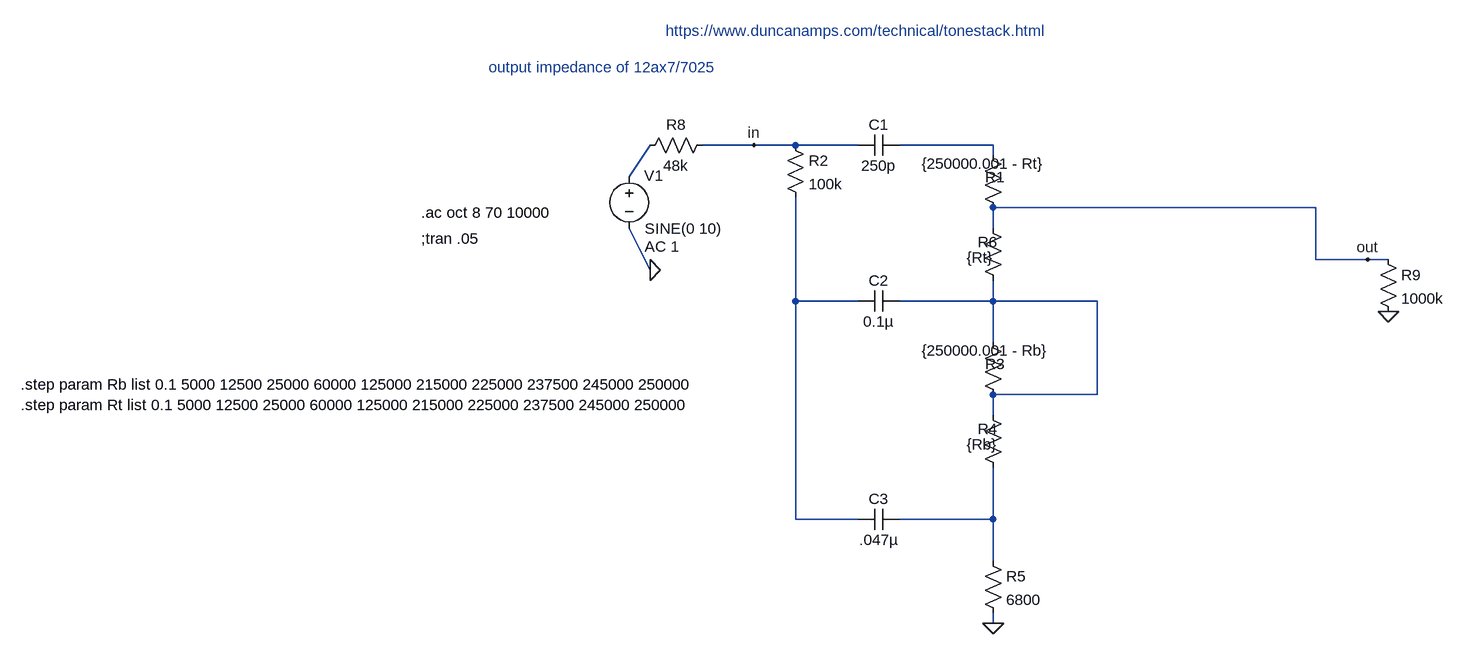
[diagram p0: schematic tone_AB763_FMV.asc]
tone_AB763_FMV.asc, the LTspice schematic file:
Version 4
SHEET 1 1168 888
WIRE 96 80 16 80
WIRE 160 80 96 80
WIRE 256 80 160 80
WIRE 464 80 320 80
WIRE 464 96 464 80
WIRE -96 128 -64 80
WIRE 960 176 464 176
WIRE 464 208 464 176
WIRE 960 256 960 176
WIRE 1040 256 960 256
WIRE 1072 256 1040 256
WIRE -64 272 -96 208
WIRE 160 320 160 160
WIRE 256 320 160 320
WIRE 464 320 464 288
WIRE 464 320 320 320
WIRE 624 320 464 320
WIRE 464 384 464 320
WIRE 624 464 624 320
WIRE 624 464 464 464
WIRE 464 496 464 464
WIRE 160 656 160 320
WIRE 256 656 160 656
WIRE 464 656 464 576
WIRE 464 656 320 656
WIRE 464 720 464 656
WIRE 464 816 464 800
FLAG -64 272 0
FLAG 1040 256 out
FLAG 96 80 in
FLAG 1072 336 0
FLAG 464 816 0
SYMBOL voltage -96 112 R0
WINDOW 123 24 124 Left 2
WINDOW 39 0 0 Left 0
WINDOW 0 23 15 Left 2
SYMATTR Value2 AC 1
SYMATTR InstName V1
SYMATTR Value SINE(0 10)
SYMBOL res 448 80 R0
WINDOW 3 -94 28 Left 2
WINDOW 0 4 49 Left 2
SYMATTR Value {250000.001 - Rt}
SYMATTR InstName R1
SYMBOL res 448 192 R0
WINDOW 3 -25 61 Left 2
WINDOW 0 -8 37 Left 2
SYMATTR Value {Rt}
SYMATTR InstName R6
SYMBOL res 32 64 R90
WINDOW 0 0 56 VBottom 2
WINDOW 3 32 56 VTop 2
SYMATTR InstName R8
SYMATTR Value 48k
SYMBOL res 1056 240 R0
SYMATTR InstName R9
SYMATTR Value 1000k
SYMBOL res 144 64 R0
SYMATTR InstName R2
SYMATTR Value 100k
SYMBOL cap 320 64 R90
WINDOW 0 0 32 VBottom 2
WINDOW 3 32 32 VTop 2
SYMATTR InstName C1
SYMATTR Value 250p
SYMBOL cap 320 304 R90
WINDOW 0 0 32 VBottom 2
WINDOW 3 32 32 VTop 2
SYMATTR InstName C2
SYMATTR Value 0.1µ
SYMBOL cap 320 640 R90
WINDOW 0 0 32 VBottom 2
WINDOW 3 32 32 VTop 2
SYMATTR InstName C3
SYMATTR Value .047µ
SYMBOL res 448 368 R0
WINDOW 3 -94 28 Left 2
WINDOW 0 4 49 Left 2
SYMATTR Value {250000.001 - Rb}
SYMATTR InstName R3
SYMBOL res 448 480 R0
WINDOW 3 -25 61 Left 2
WINDOW 0 -8 37 Left 2
SYMATTR Value {Rb}
SYMATTR InstName R4
SYMBOL res 448 704 R0
SYMATTR InstName R5
SYMATTR Value 6800
TEXT -416 224 Left 2 !;tran .05
TEXT -416 184 Left 2 !.ac oct 8 70 10000
TEXT -1032 448 Left 2 !.step param Rb list 0.1 5000 12500 25000 60000 125000 215000 225000 237500 245000 250000
TEXT -1032 480 Left 2 !.step param Rt list 0.1 5000 12500 25000 60000 125000 215000 225000 237500 245000 250000
TEXT -40 -96 Left 2 ;https://www.duncanamps.com/technical/tonestack.html
TEXT -312 -40 Left 2 ;output impedance of 12ax7/7025

The netlist it stands for:
* tone_AB763_FMV.asc
V1 N002 0 SINE(0 10) AC 1
R1 N001 out {250000.001 - Rt}
R6 out N004 {Rt}
R8 in N002 48k
R9 out 0 1000k
R2 in N003 100k
C1 N001 in 250p
C2 N004 N003 0.1µ
C3 N005 N003 .047µ
R3 N004 N004 {250000.001 - Rb}
R4 N004 N005 {Rb}
R5 N005 0 6800
;tran .05
.ac oct 8 70 10000
.step param Rb list 0.1 5000 12500 25000 60000 125000 215000 225000 237500 245000 250000
.step param Rt list 0.1 5000 12500 25000 60000 125000 215000 225000 237500 245000 250000
* https://www.duncanamps.com/technical/tonestack.html
* output impedance of 12ax7/7025
.backanno
.end

* Results of the author's LTspice run, read from the files saved beside the schematic
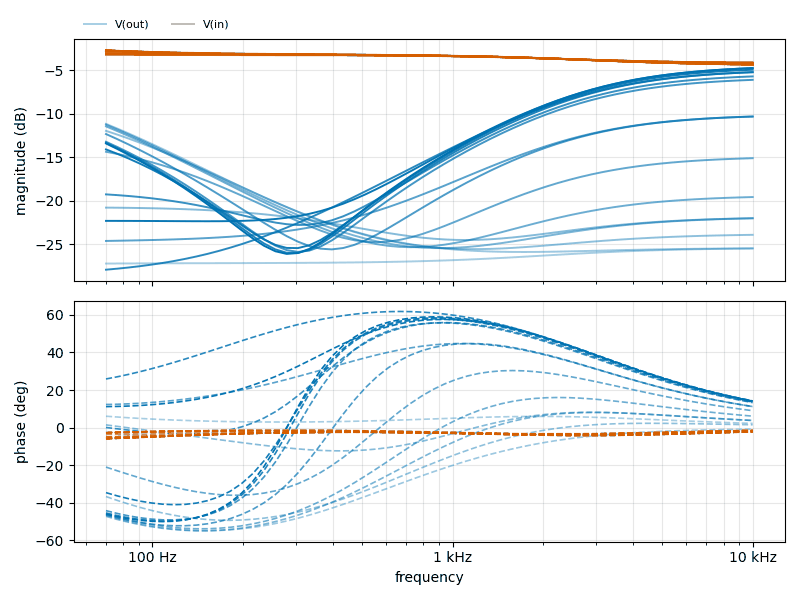
[diagram p1: AC Analysis of tone_AB763_FMV.asc, plotted from the saved traces]
* AC Analysis, 121 runs:
*   V(out) [run 1]: -27.23 dB at 70 Hz, -25.50 dB at 10 kHz, peak -25.50 dB at 10 kHz
*   V(out) [run 2]: -11.15 dB at 70 Hz, -25.47 dB at 10 kHz, peak -11.15 dB at 70 Hz, 3 dB below the peak at 109.9 Hz
*   V(out) [run 3]: -11.95 dB at 70 Hz, -23.92 dB at 10 kHz, peak -11.95 dB at 70 Hz, 3 dB below the peak at 118.9 Hz
*   V(out) [run 4]: -20.79 dB at 70 Hz, -22.01 dB at 10 kHz, peak -20.79 dB at 70 Hz, 3 dB below the peak at 633.2 Hz
*   V(out) [run 5]: -11.23 dB at 70 Hz, -22.02 dB at 10 kHz, peak -11.23 dB at 70 Hz, 3 dB below the peak at 109.1 Hz
*   V(out) [run 6]: -11.44 dB at 70 Hz, -19.57 dB at 10 kHz, peak -11.44 dB at 70 Hz, 3 dB below the peak at 109.5 Hz
*   V(out) [run 7]: -14.36 dB at 70 Hz, -15.10 dB at 10 kHz, peak -14.36 dB at 70 Hz, 3 dB below the peak at 143 Hz
*   V(out) [run 8]: -24.63 dB at 70 Hz, -10.30 dB at 10 kHz, peak -10.30 dB at 10 kHz, 3 dB below the peak at 2.234 kHz
*   V(in) [run 1]: -3.18 dB at 70 Hz, -4.11 dB at 10 kHz, peak -3.18 dB at 70 Hz
*   V(in) [run 2]: -2.70 dB at 70 Hz, -4.11 dB at 10 kHz, peak -2.70 dB at 70 Hz
*   V(in) [run 3]: -2.69 dB at 70 Hz, -4.11 dB at 10 kHz, peak -2.69 dB at 70 Hz
*   V(in) [run 4]: -3.05 dB at 70 Hz, -4.11 dB at 10 kHz, peak -3.05 dB at 70 Hz
*   V(in) [run 5]: -2.70 dB at 70 Hz, -4.11 dB at 10 kHz, peak -2.70 dB at 70 Hz
*   V(in) [run 6]: -2.70 dB at 70 Hz, -4.11 dB at 10 kHz, peak -2.70 dB at 70 Hz
*   V(in) [run 7]: -2.76 dB at 70 Hz, -4.13 dB at 10 kHz, peak -2.76 dB at 70 Hz
*   V(in) [run 8]: -3.13 dB at 70 Hz, -4.17 dB at 10 kHz, peak -3.13 dB at 70 Hz